# EAGLE schematic platform (EAGLE 6.1)
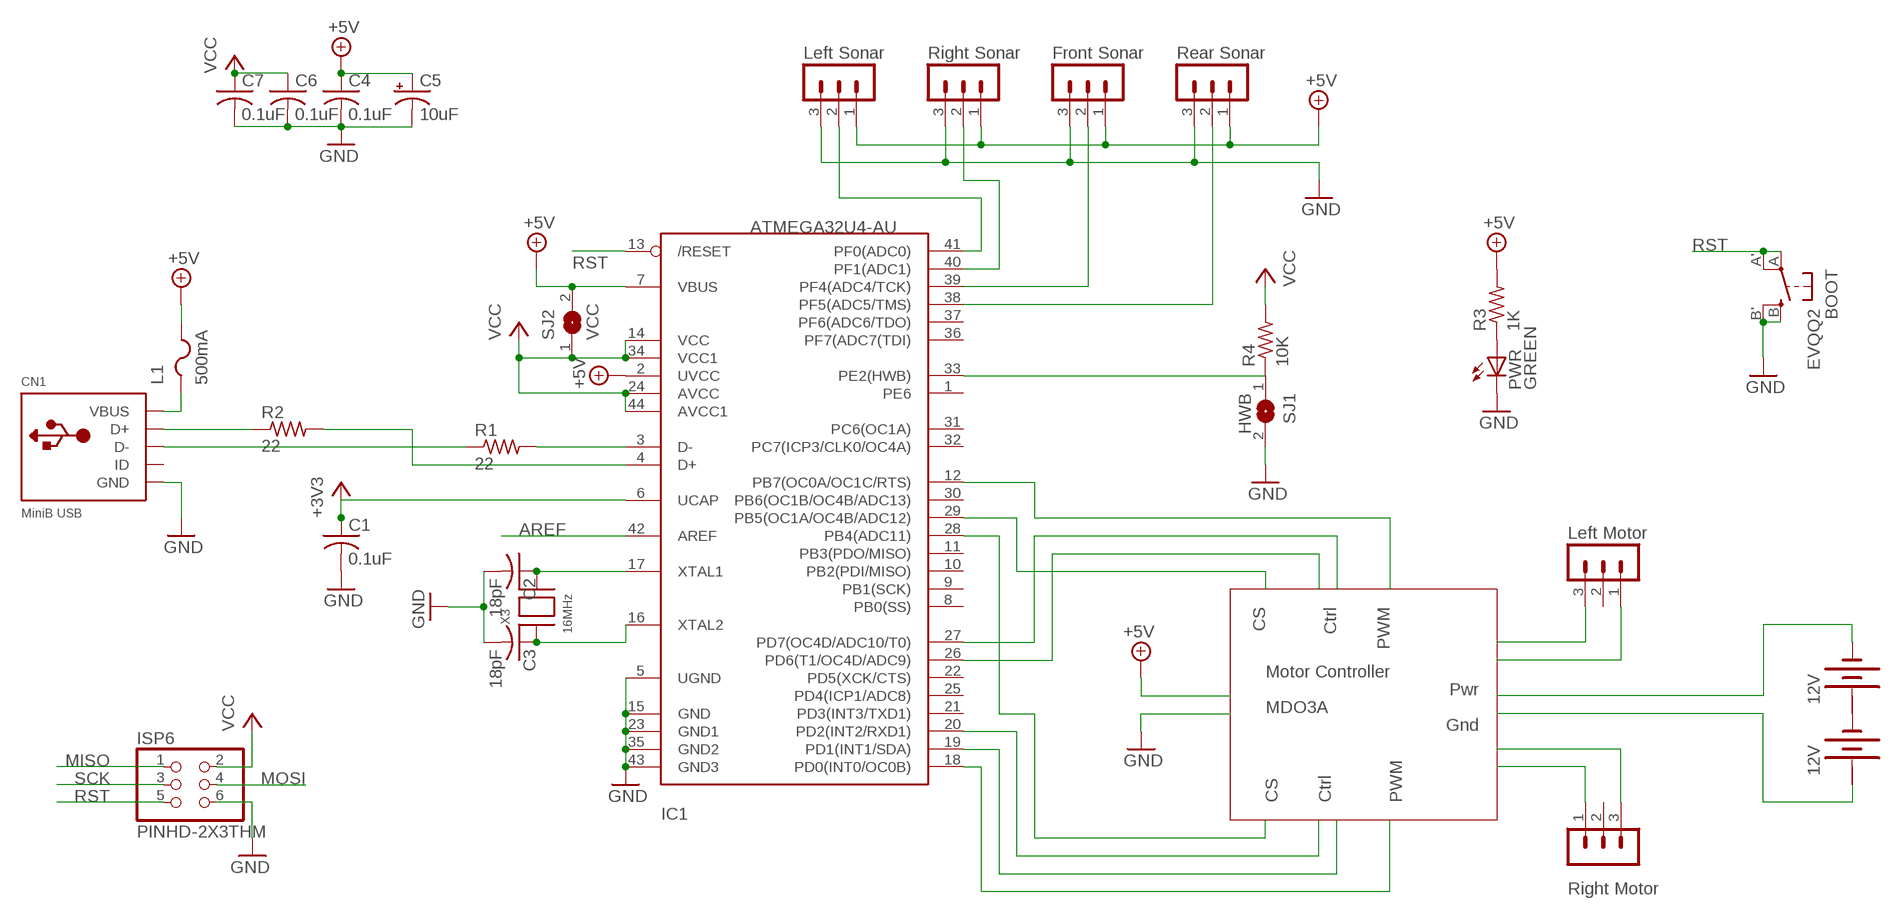
[diagram p0: schematic, sheet 1]

## Parts
BAT1  12V  BATTERY  [BATTERY]
BAT2  12V  BATTERY  [BATTERY]
BOOT  EVQQ2  [EVQ-Q2]
C1  0.1uF  C-USC0805K  [C0805K]
C2  18pF  C-USC0805K  [C0805K]
C3  18pF  C-USC0805K  [C0805K]
C4  0.1uF  C-USC0805K  [C0805K]
C5  10uF  CPOL-USA/3216-18R  [A/3216-18R]
C6  0.1uF  C-USC0805K  [C0805K]
C7  0.1uF  C-USC0805K  [C0805K]
CN1  MiniB USB  USBMINIB  [USB-MINIB]
IC1  ATMEGA32U4-AU  [TQFP44]
ISP6  PINHD-2X3THM  [ISP6]
L1  500mA  PTCFUSE-1206  [R1206]
PWR  GREEN  LEDCHIPLED_0805  [CHIPLED_0805]
R1  22  R-US_R0805  [R0805]
R2  22  R-US_R0805  [R0805]
R3  1K  R-US_R0805  [R0805]
R4  10K  R-US_R0805  [R0805]
SJ1  HWB  SJ  [SJ]
SJ2  VCC  SJ  [SJ]
SV1  Right Motor  MA03-1  [MA03-1]
SV2  Left Motor  MA03-1  [MA03-1]
SV3  Left Sonar  MA03-1  [MA03-1]
SV4  Right Sonar  MA03-1  [MA03-1]
SV5  Front Sonar  MA03-1  [MA03-1]
SV6  Rear Sonar  MA03-1  [MA03-1]
X3  16MHz  XTALNX5032  [NX5032]

## Nets
+3V3: C1.1 IC1.6(UCAP)
+5V: C4.1 C5.+ IC1.2(UVCC) IC1.7(VBUS) L1.2 R3.2 SJ2.2 SV3.1 SV4.1 SV5.1 SV6.1
AREF: IC1.42(AREF)
GND: BOOT.B'(S1) BOOT.B(S) C1.2 C2.2 C3.2 C4.2 C5.- C6.2 C7.2 CN1.GND IC1.5(UGND) IC1.15(GND) IC1.23(GND1) IC1.35(GND2) IC1.43(GND3) ISP6.6 PWR.C SJ1.2 SV3.3 SV4.3 SV5.3 SV6.3
HWB: IC1.33(PE2(HWB)) R4.1 SJ1.1
MISO: ISP6.1
MOSI: ISP6.4
N$1: BAT1.- BAT2.+
N$2: BAT2.-
N$3: BAT1.+
N$4: SV1.1
N$5: SV1.3
N$6: SV2.3
N$7: SV2.1
N$8: IC1.3(D-) R1.2
N$9: IC1.4(D+) R2.2
N$10: C3.1 IC1.16(XTAL2) X3.P$1
N$11: C2.1 IC1.17(XTAL1) X3.P$2
N$12: PWR.A R3.1
N$13: IC1.28(PB4(ADC11))
N$14: CN1.D+ R2.1
N$15: CN1.D- R1.1
N$16: IC1.29(PB5(OC1A/OC4B/ADC12))
N$17: IC1.18(PD0(INT0/OC0B))
N$18: IC1.12(PB7(OC0A/OC1C/RTS))
N$19: IC1.27(PD7(OC4D/ADC10/T0))
N$20: IC1.26(PD6(T1/OC4D/ADC9))
N$21: IC1.20(PD2(INT2/RXD1))
N$22: IC1.19(PD1(INT1/SDA))
N$23: IC1.41(PF0(ADC0)) SV3.2
N$24: IC1.40(PF1(ADC1)) SV4.2
N$25: IC1.38(PF5(ADC5/TMS)) SV6.2
PF4: IC1.39(PF4(ADC4/TCK)) SV5.2
RST: BOOT.A'(P1) BOOT.A(P) IC1.13(/RESET) ISP6.5
SCK: ISP6.3
VBUS: CN1.VBUS L1.1
VCC: C6.1 C7.1 IC1.14(VCC) IC1.24(AVCC) IC1.34(VCC1) IC1.44(AVCC1) ISP6.2 R4.2 SJ2.1
Unconnected: CN1.ID IC1.1(PE6) IC1.8(PB0(SS)) IC1.9(PB1(SCK)) IC1.10(PB2(PDI/MISO)) IC1.11(PB3(PDO/MISO)) IC1.21(PD3(INT3/TXD1)) IC1.22(PD5(XCK/CTS)) IC1.25(PD4(ICP1/ADC8)) IC1.30(PB6(OC1B/OC4B/ADC13)) IC1.31(PC6(OC1A)) IC1.32(PC7(ICP3/CLK0/OC4A)) IC1.36(PF7(ADC7(TDI)) IC1.37(PF6(ADC6/TDO)) SV1.2 SV2.2

## Notes on the sheet
- CS | Ctrl | PWM
- Motor Controller
- Pwr
- MDO3A
- Gnd
- CS | Ctrl | PWM

## Power pins joined to a net without a drawn wire
+: BAT1.+@1(+) BAT2.+@1(+)

## Library data of the parts
BAT1 BAT2 = special:BATTERY: BATTERY
BOOT = adaprog:EVQQ2
C1-C4 C6 C7 = adafruit:C-US: CAPACITOR, American symbol
C5 = adafruit:CPOL-US: POLARIZED CAPACITOR, American symbol
CN1 = adafruit:USB: USB Connectors USBMINIB - Surface Mount Female Mini-B USB Connector 4UConnector: 06564 By microbuilder.eu Thru-hole RA Female Mini-B USB Connector 4UConnector: 18732 By ladyada.net
IC1 = adaprog:ATMEGA32U4
ISP6 = adaprog:PINHD-2X3
L1 = adafruit:PTCFUSE: PTC fuses, resettable thermistors
PWR = adafruit:LED: LED OSRAM: - CHIPLED LG R971, LG N971, LY N971, LG Q971, LY Q971, LO R971, LY R971 LH N974, LH R974 LS Q976, LO Q976, LY Q976 LO Q996 - Hyper CHIPLED LW Q18S LB Q993, LB Q99A, LB R99A - SideLED LS A670, LO A670, LY A670, LG A670, LP A670 LB A673, LV A673, LT A673, LW A673 LH A674 LY A675 LS A676, LA A676, LO A676, LY A676, LW A676 LS A679, LY A679, LG A679 - Hyper Micro SIDELED® LS Y876, LA Y876, LO Y876, LY Y876 LT Y87S - SmartLED LW L88C, LW L88S LB L89C, LB L89S, LG L890 LS L89K, LO L89K, LY L89K LS L896, LA L896, LO L896, LY L896 - TOPLED LS T670, LO T670, LY T670, LG T670, LP T670 LSG T670, LSP T670, LSY T670, LOP T670, LYG T670 LG T671, LOG T671, LSG T671 LB T673, LV T673, LT T673, LW T673 LH T674 LS T676, LA T676, LO T676, LY T676, LB T676, LH T676, LSB T676, LW T676 LB T67C, LV T67C, LT T67C, LS T67K, LO T67K, LY T67K, LW E67C LS E67B, LA E67B, LO E67B, LY E67B, LB E67C, LV E67C, LT E67C LW T67C LS T679, LY T679, LG T679 LS T770, LO T770, LY T770, LG T770, LP T770 LB T773, LV T773, LT T773, LW T773 LH T774 LS E675, LA E675, LY E675, LS T675 LS T776, LA T776, LO T776, LY T776, LB T776 LHGB T686 LT T68C, LB T68C - Hyper Mini TOPLED® LB M676 - Mini TOPLED Santana® LG M470 LS M47K, LO M47K, LY M47K Source: http://www.osram.convergy.de/
R1-R4 = adafruit:R-US_: RESISTOR, American symbol
SJ1 SJ2 = jumper:SJ: SMD solder JUMPER
SV1-SV6 = con-lstb:MA03-1: PIN HEADER; OC_FARNELL: unknown; OC_NEWARK: unknown
X3 = adaprog:XTAL